# EAGLE design block_demux_pwm (EAGLE 7.7.0)
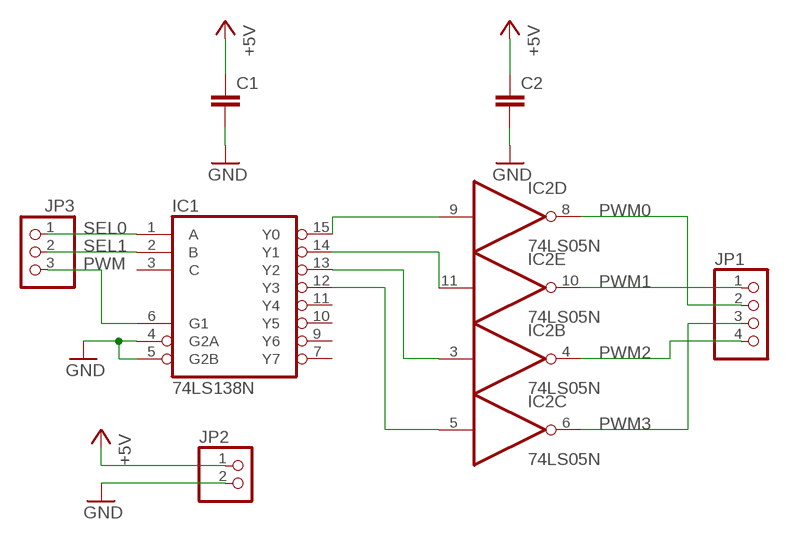
[diagram p0: schematic, sheet 1]

## Parts
C1  C-EU050-025X075  [C050-025X075]
C2  C-EU050-025X075  [C050-025X075]
IC1  74LS138N  [DIL16]
IC2  74LS05N  [DIL14]
JP1  PINHD-1X4  [1X04]
JP2  PINHD-1X2  [1X02]
JP3  PINHD-1X3  [1X03]

## Nets
GND: C1.2 C2.2 IC1.4(G2A) IC1.5(G2B) JP2.2
N$5: IC1.15(Y0) IC2.9(D:I)
N$6: IC1.14(Y1) IC2.11(E:I)
N$7: IC1.13(Y2) IC2.3(B:I)
N$8: IC1.12(Y3) IC2.5(C:I)
PWM: IC1.6(G1) JP3.3
PWM0: IC2.8(D:O) JP1.2
PWM1: IC2.10(E:O) JP1.1
PWM2: IC2.4(B:O) JP1.4
PWM3: IC2.6(C:O) JP1.3
SEL0: IC1.1(A) JP3.1
SEL1: IC1.2(B) JP3.2
VCC: C1.1 C2.1 JP2.1 ; supply symbol labelled +5V
Unconnected: IC1.3(C) IC1.7(Y7) IC1.9(Y6) IC1.10(Y5) IC1.11(Y4) IC2.1(A:I) IC2.2(A:O) IC2.12(F:O) IC2.13(F:I)

## Power pins joined to a net without a drawn wire
GND: IC1.8(GND) IC2.7(P:GND)
VCC: IC1.16(VCC) IC2.14(P:VCC)

## Library data of the parts
C1 C2 = rcl:C-EU: CAPACITOR, European symbol
IC1 = 74xx-eu:74*138: 3-line to 8-line DECODER/DEMULTIPLEXER
IC2 = 74xx-eu:74*05: Hex INVERTER, open collector
JP1 = pinhead:PINHD-1X4: PIN HEADER
JP2 = pinhead:PINHD-1X2: PIN HEADER
JP3 = pinhead:PINHD-1X3: PIN HEADER

## Board
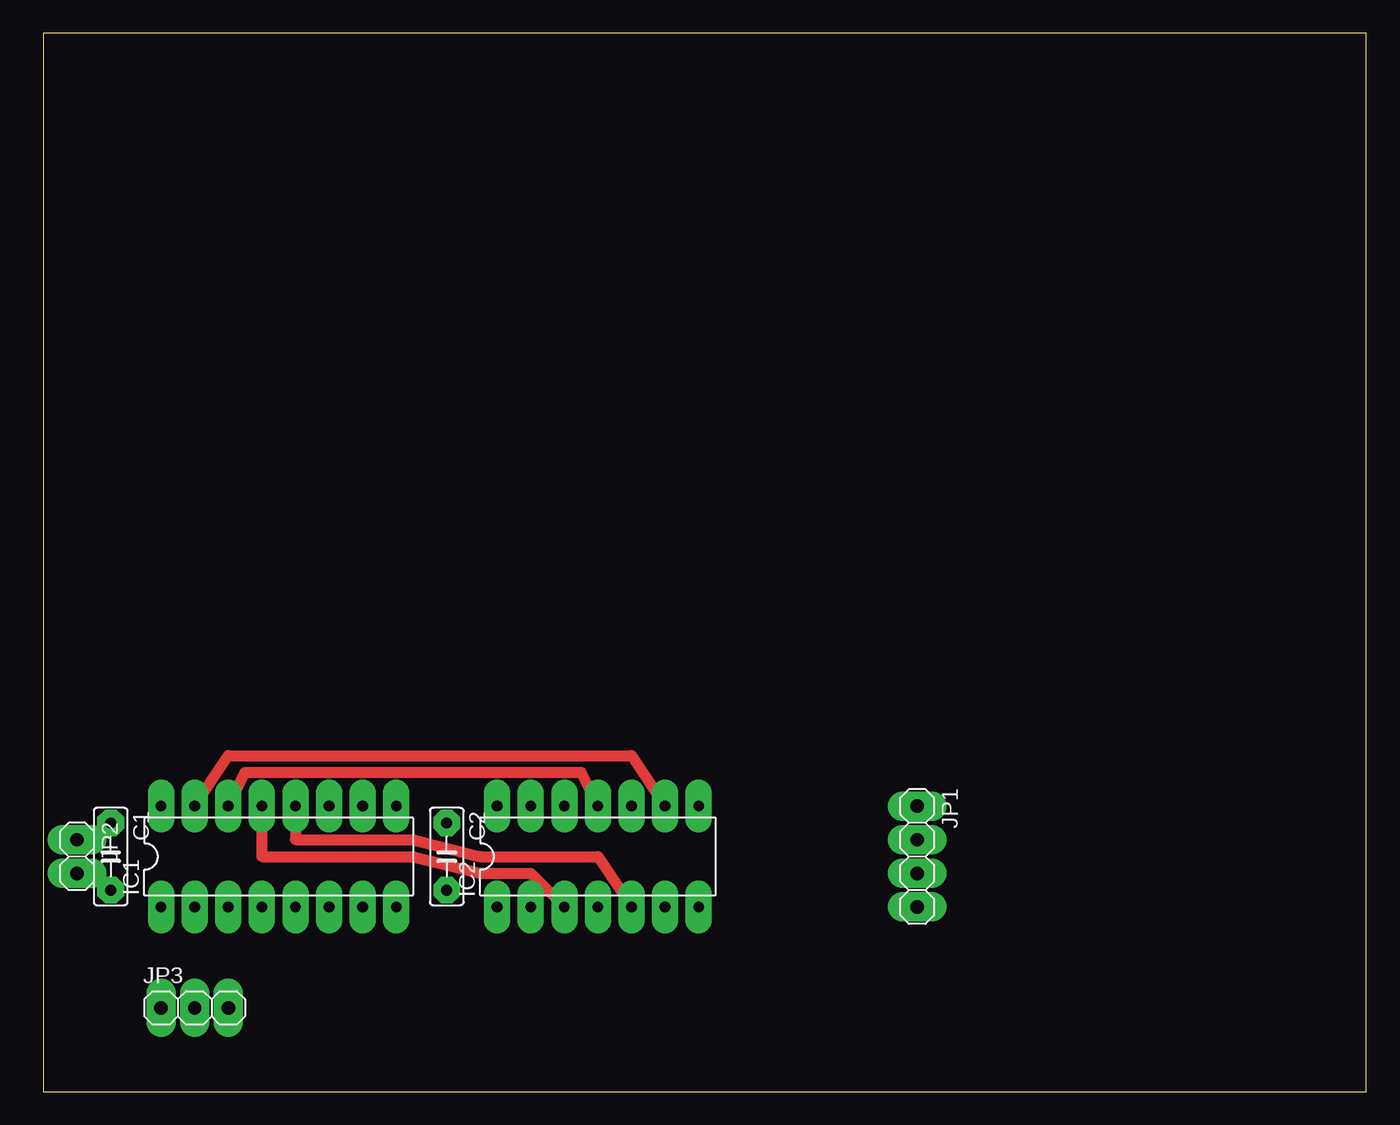
[diagram p1: board, top side]
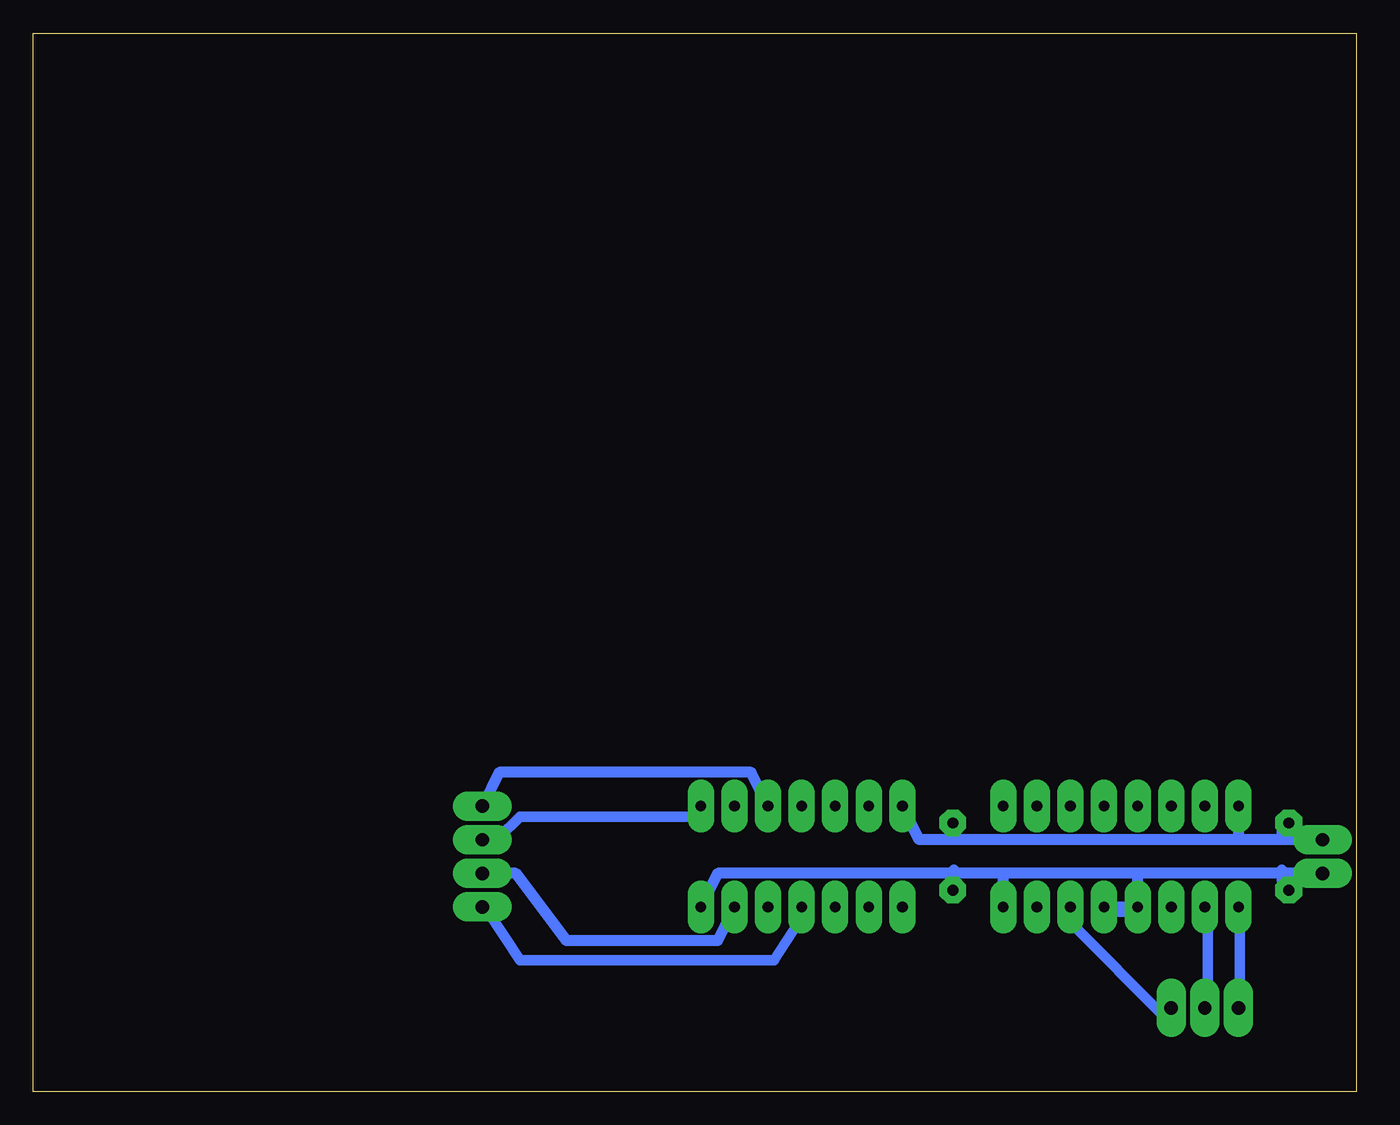
[diagram p2: board, bottom side, seen from below]

Size 100 x 80 mm. Coordinates in mm from the lower left corner, seen from the top.
Outline: 0,0 100,0 100,80 0,80 0,0
Copper layers (1*16): Top 0.035mm / dielectric 1.5mm / Bottom 0.035mm
Design rules "default *": minimum track width 0.8mm, minimum drill 0.8mm, track to track 0.8mm, track to pad 0.8mm, pad to pad 0.45mm, via to via 0.8mm, smd to smd 8mil, copper to edge 10mil, drill to drill 8mil, minimum pad ring 0.6mm, minimum via ring 0.6mm, stop-mask expansion 0mil, vias tented up to drill 0mil, thermal gap 10mil

### Footprints (pad centres in the part's own frame; a part is rotated, then mirrored left to right if it is on the bottom)
C050-025X075 = drill 0.813 octagon: 1 -2.54,0; 2 2.54,0
DIL16 = drill 0.813 long: 1 -8.89,-3.81; 2 -6.35,-3.81; 3 -3.81,-3.81; 4 -1.27,-3.81; 5 1.27,-3.81; 6 3.81,-3.81; 7 6.35,-3.81; 8 8.89,-3.81; 9 8.89,3.81; 10 6.35,3.81; 11 3.81,3.81; 12 1.27,3.81; 13 -1.27,3.81; 14 -3.81,3.81; 15 -6.35,3.81; 16 -8.89,3.81
DIL14 = drill 0.813 long: 1 -7.62,-3.81; 2 -5.08,-3.81; 3 -2.54,-3.81; 4 0,-3.81; 5 2.54,-3.81; 6 5.08,-3.81; 7 7.62,-3.81; 8 7.62,3.81; 9 5.08,3.81; 10 2.54,3.81; 11 0,3.81; 12 -2.54,3.81; 13 -5.08,3.81; 14 -7.62,3.81
1X04 = drill 1.016 long: 1 -3.81,0; 2 -1.27,0; 3 1.27,0; 4 3.81,0
1X02 = drill 1.016 long: 1 -1.27,0; 2 1.27,0
1X03 = drill 1.016 long: 1 -2.54,0; 2 0,0; 3 2.54,0

### Placement (x,y rotation side)
C1  5.08,17.78 270 top
C2  30.48,17.78 270 top
IC1  17.78,17.78 0 top
IC2  41.91,17.78 0 top
JP1  66.04,17.78 270 top
JP2  2.54,17.78 270 top
JP3  11.43,6.35 0 top

### Tracks (layer width: path | path; a pad name or v marks a point on that pad's centre or on a via)
GND
  Bottom 0.8: IC1.4 16.8,13.6 18.4,13.6 IC1.5 | C1.2 5.6,16 5.6,16.51 5.6,16.8 | 30.4,16.8 30.4,16.51 30.4,16 C2.2
  Bottom 0.813: JP2.2 5.6,16.51 16.51,16.51 | IC1.5 IC1.4 16.51,16.51 | 16.51,16.51 26.67,16.51 | IC1.8 26.67,16.51 | 26.67,16.51 30.4,16.51 48.26,16.51 IC2.7
N$5
  Top 0.813: IC1.15 13.97,25.4 44.45,25.4 IC2.9
N$6
  Top 0.813: IC1.14 15.24,24.13 40.64,24.13 IC2.11
N$7
  Top 0.813: IC1.13 16.51,17.78 27.94,17.78 33.02,16.51 36.83,16.51 IC2.3
N$8
  Top 0.813: IC1.12 19.05,19.05 27.94,19.05 33.02,17.78 41.91,17.78 IC2.5
PWM
  Bottom 0.8: IC1.6 21.6,13.6 21.6,12.8 14.4,5.6 JP3.3
PWM0
  Bottom 0.8: 49.6,21.6 IC2.8 49.6,20.8 63.2,20.8 64.8,19.2 65.6,19.2 JP1.2
PWM1
  Bottom 0.813: IC2.10 45.72,24.13 64.77,24.13 JP1.1
PWM2
  Bottom 0.8: IC2.4 41.6,13.6 44,9.93 63.2,9.93 65.6,13.6 JP1.4
PWM3
  Bottom 0.813: IC2.6 48.26,11.43 59.69,11.43 63.5,16.51 JP1.3
SEL0
  Bottom 0.8: IC1.1 8.8,13.6 8.8,6.4 JP3.1
SEL1
  Bottom 0.8: IC1.2 11.2,13.6 11.2,6.4 JP3.2
VCC
  Bottom 0.8: 5.6,19.05 5.6,20 C1.1 | 30.4,19.05 30.4,20 C2.1
  Bottom 0.813: JP2.1 5.6,19.05 8.89,19.05 | IC1.16 8.89,19.05 | 8.89,19.05 30.4,19.05 33.02,19.05 IC2.14